# Altium schematic sheet 23_Alimentación_Hub.SchDoc
size A4; SheetNumber: 10; SheetTotal: 19
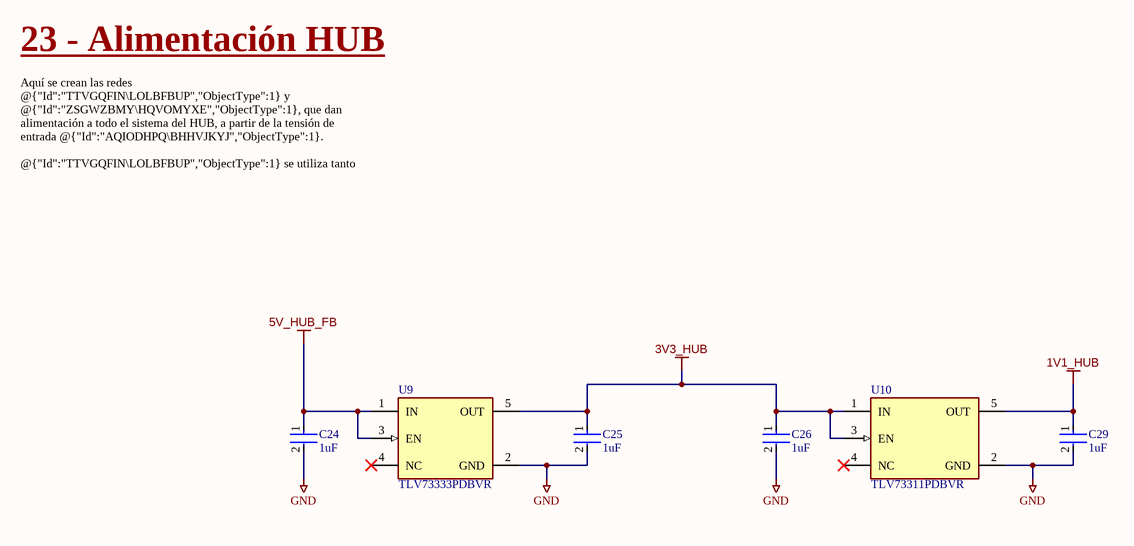
[diagram p0: 23_Alimentación_Hub.SchDoc]

## Parts
C24  1uF  [FP-C0402C-BB-IPC_B]
C25  1uF  [FP-C0402C-BB-IPC_B]
C26  1uF  [FP-C0402C-BB-IPC_B]
C29  1uF  [FP-C0402C-BB-IPC_B]
U9  TLV73333PDBVR  [FP-DBV0005A-MFG]
U10  TLV73311PDBVR  [FP-DBV0005A-IPC_C]

## Nets
1V1_HUB: C29.1 U10.5(OUT)
3V3_HUB: C25.1 C26.1 U9.5(OUT) U10.1(IN) U10.3(EN)
5V_HUB_FB: C24.1 U9.1(IN) U9.3(EN)
GND: C24.2 C25.2 C26.2 C29.2 U9.2(GND) U10.2(GND)

Not connected (* = marked no-connect by the designer): U9 4(NC)*; U10 4(NC)*

## Notes on the sheet
- 23 - Alimentación HUB
- Aquí se crean las redes @{"Id":"TTVGQFIN\LOLBFBUP","ObjectType":1} y @{"Id":"ZSGWZBMY\HQVOMYXE","ObjectType":1}, que dan alimentación a todo el sistema del HUB, a partir de la tensión de entrada @{"Id":"AQIODHPQ\BHHVJKYJ","ObjectType":1}.
  @{"Id":"TTVGQFIN\LOLBFBUP","ObjectType":1} se utiliza tanto en 21_Controlador_USB como en 22_Hub.
  @{"Id":"ZSGWZBMY\HQVOMYXE","ObjectType":1} se utiliza exclusivamente en 22_Hub.

## Library data of the parts
C24-C26 C29 = CMP-03020-034679-1: CAP CER 1UF 16V X5R 0402; Dielectric Material: Ceramic; Tolerance: 10%; RoHS Compliant: Yes; Voltage Rating (DC): 16V; Voltage Rating: 16V; Max Operating Temperature: 85°C; Packaging: Cut Tape; Width: 0.02inch; Dielectric: X5R; Lead Free: Lead Free; Min Operating Temperature: -55°C; Mount: Surface Mount; Case/Package: 0402; Thickness: 0.022inch; REACH SVHC: No SVHC; Length: 0.039inch; Case Code (Metric): 1005; Case Code (Imperial): 0402; Capacitance: 1uF
U9 = CMP-04917-000053-1: IC REG LINEAR 3.3V 300MA SOT23-5; Manufacturer: Texas Instruments; Max Junction Temp: +125°C; Accuracy Percentage: 1%; Min Supply Voltage: 1.4V; Number Of Outputs: 1; Dropout Voltage: 125mV; Nominal Supply Current: 34uA; Max Supply Voltage: 5.5V; Output Type: Fixed; Standoff Height: 0mm; Digikey Description: IC REG LINEAR 3.3V 300MA SOT23-5; Manufacturer Part Number: TLV73333PDBVR; Temperature Range High: +125°C; Temperature: -40°C to +125°C; Output Current: 300mA; Mouser Description: LDO Voltage Regulators Capacitr-Free 300-mA 5-SOT-23 -40 to 125; Automotive: No; Height: 1.45mm; Device Class L3: Voltage Regulators - Linear; ComponentLink2Description: Datasheet; Device Class L1: Integrated Circuits (ICs); ComponentLink2URL: http://www.ti.com/lit/ds/symlink/tlv733p.pdf; Octopart: https://octopart.com/tlv73333pdbvr-texas+instruments-51080890; Temperature Range Low: -40°C; RoHS: TRUE; Lead Free: Yes; Output Voltage: 3.3V; Package: DBV0005A; Device Class L2: Power Management ICs; Category: IC
U10 = CMP-04917-000331-1: IC REG LINEAR 1.1V 300MA SOT23-5; Number of Regulators: 1; Quiescent Current: 34uA; Max Input Voltage: 5.5V; Min Input Voltage: 1.4V; Polarity: Positive; Power Supply Rejection Ratio (PSRR): 28dB; Output Type: Fixed; Accuracy: 1%; Dropout Voltage: 122mV; Min Current Limit: 360mA; Mount: Surface Mount; Number of Pins: 5; Case/Package: SOT-23-5; Max Output Current: 300mA; Min Operating Temperature: -40°C; Lead Free: Lead Free; Output Current: 300mA; Output Voltage: 1.1V; RoHS Compliant: Yes; Package Quantity: 3000; Number of Outputs: 1; Packaging: Tape and Reel; Contact Plating: Gold; Weight: 0.000557oz; Max Operating Temperature: 125°C